# Altium schematic sheet front_io.SchDoc
size A4
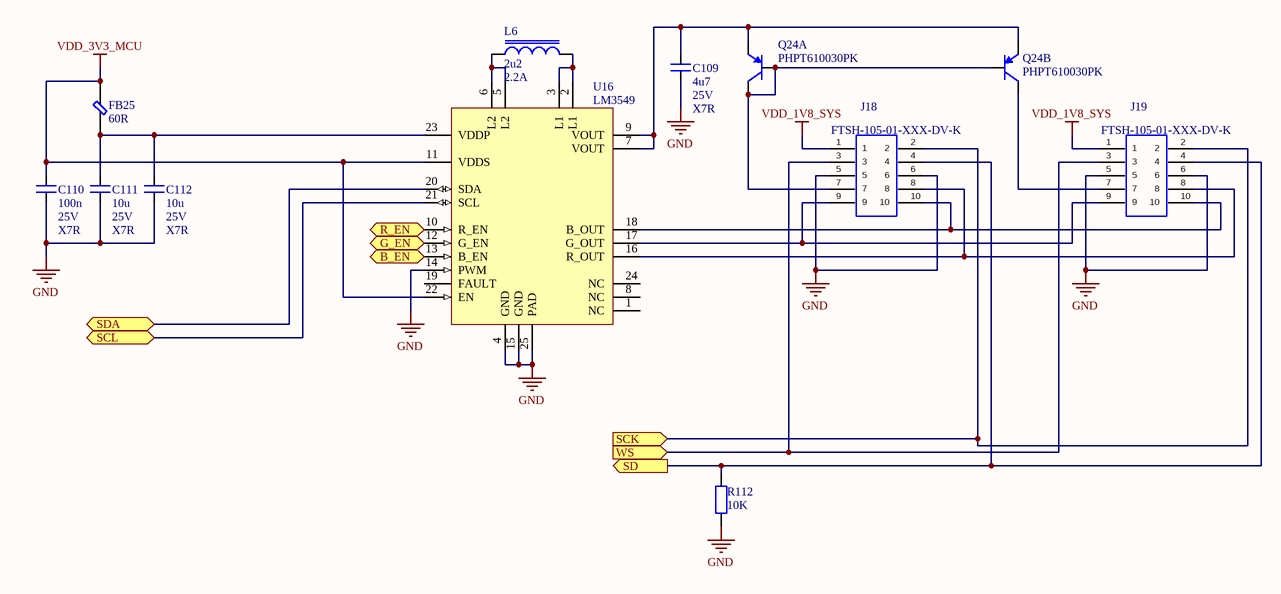
[diagram p0: front_io.SchDoc]

## Parts
C109  value 4u7  Voltage: 25V  Type: X7R  [C3216[1206]]  (hidden comment: cap)
C110  value 100n  Voltage: 25V  Type: X7R  [C1005[0402]]  (hidden comment: cap)
C111  value 10u  Voltage: 25V  Type: X7R  [C3216[1206]]  (hidden comment: cap)
C112  value 10u  Voltage: 25V  Type: X7R  [C3216[1206]]  (hidden comment: cap)
FB25  value 60R  [FBC1608X07N]  (hidden comment: Ferrite bead)
J18  FTSH-105-01-XXX-DV-K  [FTSH-105-01-XXX-DV-K]
J19  FTSH-105-01-XXX-DV-K  [FTSH-105-01-XXX-DV-K]
L6  value 2u2  Current: 2.2A  [YUDEN_NRS4018T-XXXMDGJ]  (hidden comment: ASPI-0630LR-XXXM-T15)
Q24  PHPT610030PK  [NXP_LFPAK56D127P610X105-8N]  (parts A,B of 2)
R112  value 10K  [R1005[0402]]  (hidden comment: res)
U16  LM3549  [TI_QFN50P400X400X80_HS-25M]

## Ports
B_EN (in), G_EN (in), R_EN (in), SCK (in), SCL (bidir), SD (out), SDA (bidir), WS (in)

## Nets
GND: C109.1 C110.1 C111.1 C112.1 J18.5 J18.6 J19.5 J19.6 R112.1 U16.4(GND) U16.14(PWM) U16.15(GND) U16.25(PAD)
VDD_1V8_SYS: J18.1 J19.1
VDD_3V3_MCU: C110.2 FB25.2 U16.11(VDDS) U16.22(EN)
B_EN: U16.13(B_EN) ; port B_EN
G_EN: U16.12(G_EN) ; port G_EN
R_EN: U16.10(R_EN) ; port R_EN
SCK: J18.2 J19.2 ; port SCK
SCL: U16.21(SCL) ; port SCL
SD: J18.4 J19.4 R112.2 ; port SD
SDA: U16.20(SDA) ; port SDA
WS: J18.3 J19.3 ; port WS
NetC109_2: C109.2 Q24.E1 Q24.E2 U16.7(VOUT) U16.9(VOUT)
NetC111_2: C111.2 C112.2 FB25.1 U16.23(VDDP)
NetJ18_7: J18.7 Q24.B1 Q24.B2 Q24.C1
NetJ18_8: J18.8 J19.8 U16.16(R_OUT)
NetJ18_9: J18.9 J19.9 U16.17(G_OUT)
NetJ18_10: J18.10 J19.10 U16.18(B_OUT)
NetJ19_7: J19.7 Q24.C2
NetL6_1: L6.1 U16.5(L2) U16.6(L2)
NetL6_2: L6.2 U16.2(L1) U16.3(L1)

Not connected (* = marked no-connect by the designer): U16 1(NC) 8(NC) 19(FAULT) 24(NC)

## Notes on the sheet
- Title
- Size:
- Date:
- A4
- Number:
- Time:
- Revision:
- Sheet
- of
- File:

## Library data of the parts
C109-C112 = cap: Capacitor; Manufacturer: *; Series: *
FB25 = ferrite_bead: Frequency: 100M
J18 J19 = FTSH-105-01-XXX-DV-K: TERMINAL STRIP, .050"(1.27mm) PITCH, 10 PINS, KEYED; MANUFACTURER: SAMTEC; CREATED: November 30, 2016 - Wendy Xin; PCB DECAL: FTSH-105-01-XXX-DV-K
L6 = ind
Q24 = pnp_bipolar_dual: PNP Bipolar Transistor; Published: 8-Jun-2000; LatestRevisionDate: 29-May-2009; LatestRevisionNote: IPC-7351 Footprint Added.; PackageVersion: Aug-1999; PackageReference: SOT-23B; Publisher: Altium Limited; PackageDescription: 3-Pin SOT-23 Package 0.95 mm Pitch, 2.4 mm Lead Span
R112 = res: Resistor; Tolerance: 5%